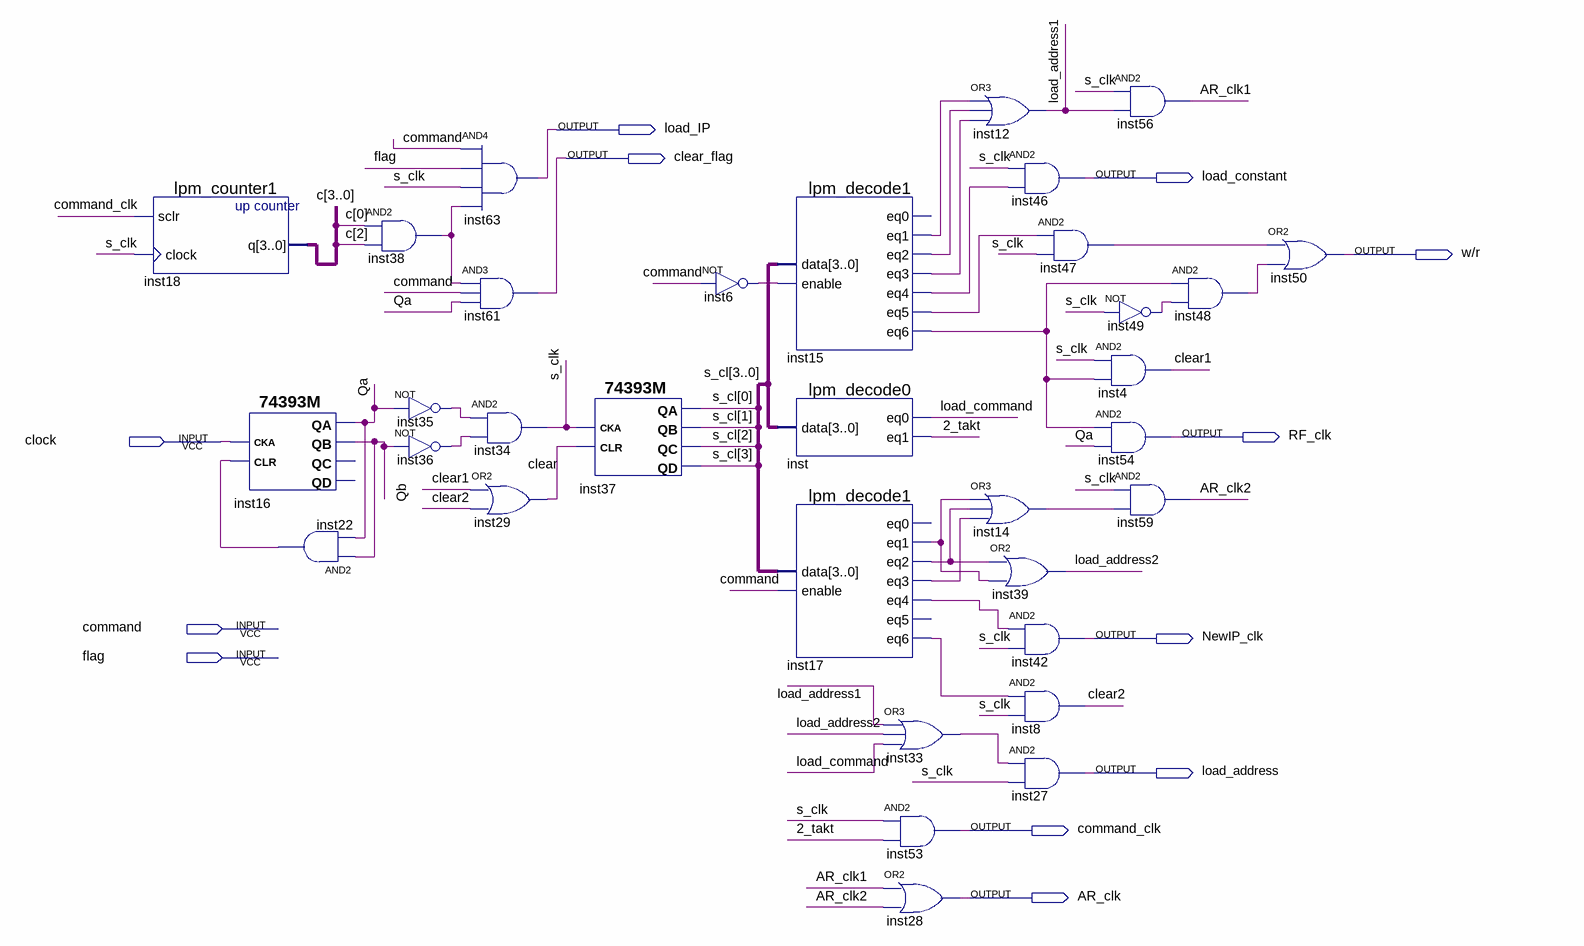
[diagram p0: schematic sheet]
// Quartus schematic LoginUnit.bdf as structural Verilog: 33 symbols, 12 pins
module LoginUnit (
  input  clock,
  input  command,
  input  flag,
  output load_IP,
  output clear_flag,
  output load_constant,
  output \w/r ,
  output RF_clk,
  output NewIP_clk,
  output load_address,
  output command_clk,
  output AR_clk
);

  wire \2_takt , AR_clk1, AR_clk2, clear, clear1, clear2, inst6_out, inst14_out, inst15_eq1, inst15_eq2,
       inst15_eq3, inst15_eq4, inst15_eq5, inst15_eq6, inst17_eq1, inst17_eq2, inst17_eq3, inst17_eq4,
       inst17_eq6, inst22_out, inst33_out, inst35_out, inst36_out, inst38_out, inst47_out, inst48_out,
       inst49_out, load_address1, load_address2, load_command, Qa, Qb, s_clk;
  wire [3:0] c, s_cl;

  lpm_counter1 inst18 (.sclr(command_clk), .clock(s_clk), .q(c));
  \74393M  inst16 (.CLR(inst22_out), .CKA(clock), .QB(Qb), .QA(Qa));  // open: QC, QD
  and inst22 (inst22_out, Qb, Qa);
  and inst38 (inst38_out, c[0], c[2]);
  not inst35 (inst35_out, Qa);
  not inst36 (inst36_out, Qb);
  and inst63 (load_IP, command, flag, s_clk, inst38_out);
  and inst61 (clear_flag, inst38_out, command, Qa);
  and inst34 (s_clk, inst35_out, inst36_out);
  or inst29 (clear, clear1, clear2);
  \74393M  inst37 (.CLR(clear), .CKA(s_clk), .QC(s_cl[2]), .QD(s_cl[3]), .QB(s_cl[1]), .QA(s_cl[0]));
  not inst6 (inst6_out, command);
  lpm_decode1 inst15 (
    .data(s_cl), .enable(inst6_out), .eq1(inst15_eq1), .eq2(inst15_eq2), .eq3(inst15_eq3), .eq4(inst15_eq4),
    .eq5(inst15_eq5), .eq6(inst15_eq6));  // open: eq0
  lpm_decode0 inst (.data(s_cl), .eq0(load_command), .eq1(\2_takt ));
  lpm_decode1 inst17 (
    .data(s_cl), .enable(command), .eq1(inst17_eq1), .eq2(inst17_eq2), .eq3(inst17_eq3), .eq4(inst17_eq4),
    .eq6(inst17_eq6));  // open: eq0, eq5
  or inst33 (inst33_out, load_address1, load_address2, load_command);
  and inst53 (command_clk, s_clk, \2_takt );
  or inst28 (AR_clk, AR_clk1, AR_clk2);
  or inst12 (load_address1, inst15_eq1, inst15_eq2, inst15_eq3);
  or inst14 (inst14_out, inst17_eq1, inst17_eq2, inst17_eq3);
  or inst39 (load_address2, inst17_eq2, inst17_eq1);
  and inst46 (load_constant, s_clk, inst15_eq4);
  and inst47 (inst47_out, inst15_eq5, s_clk);
  and inst42 (NewIP_clk, inst17_eq4, s_clk);
  and inst8 (clear2, inst17_eq6, s_clk);
  and inst27 (load_address, inst33_out, s_clk);
  and inst56 (AR_clk1, s_clk, load_address1);
  not inst49 (inst49_out, s_clk);
  and inst4 (clear1, s_clk, inst15_eq6);
  and inst54 (RF_clk, inst15_eq6, Qa);
  and inst59 (AR_clk2, s_clk, inst14_out);
  and inst48 (inst48_out, inst15_eq6, inst49_out);
  or inst50 (\w/r , inst47_out, inst48_out);
endmodule
